# EAGLE design Ziliani-Apertura_Cancello (EAGLE 9.6.1)
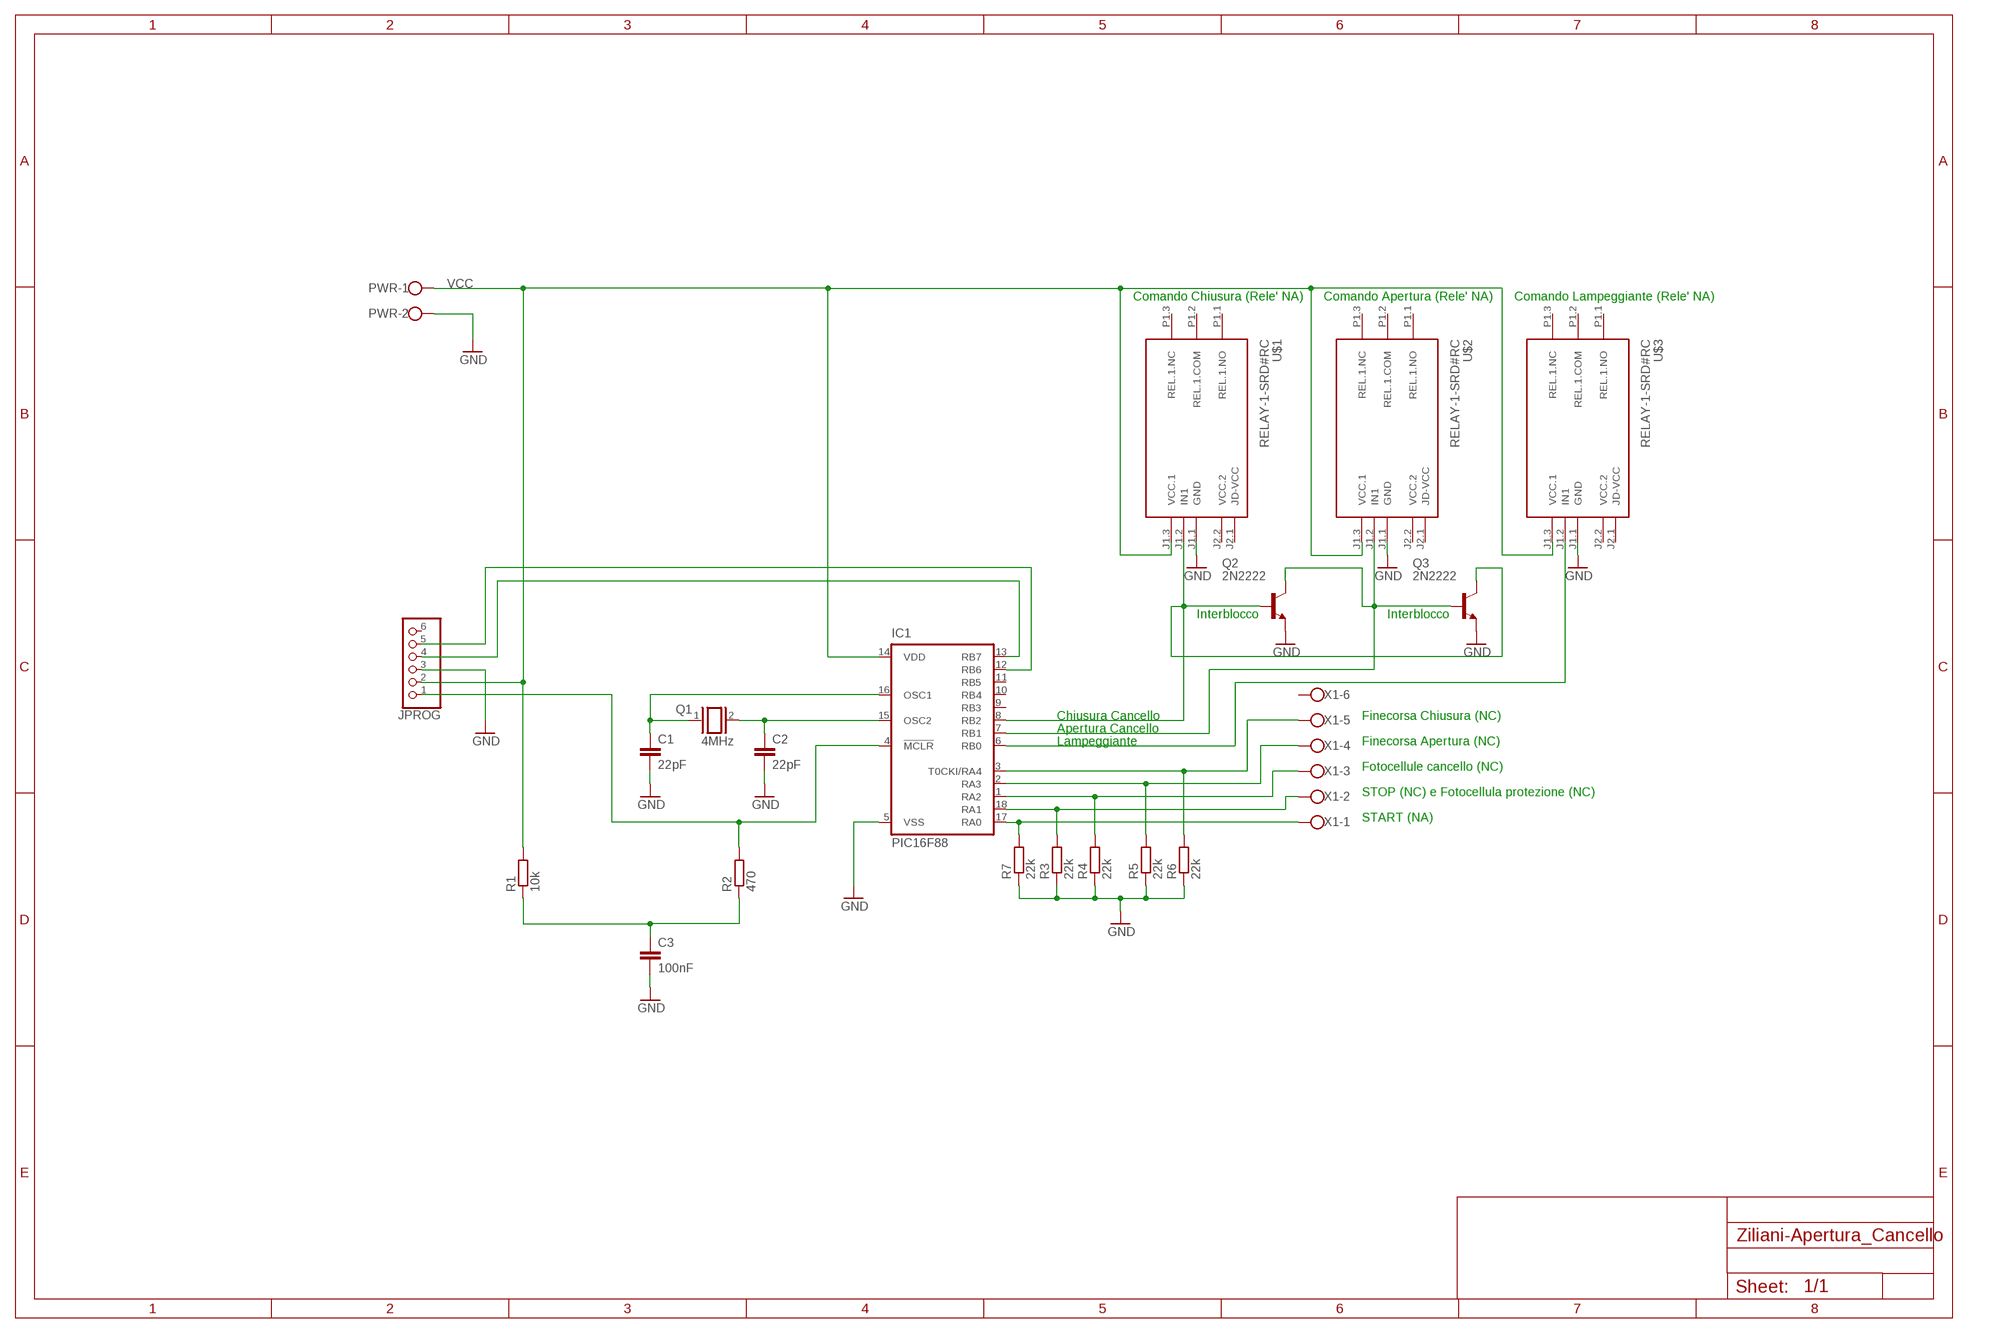
[diagram p0: schematic, sheet 1]

## Parts
C1  22pF  C-EU025-025X050  [C025-025X050]
C2  22pF  C-EU025-025X050  [C025-025X050]
C3  100nF  C-EU025-025X050  [C025-025X050]
IC1  PIC16F88  PIC16F84AP  [DIL18]
JPROG  PINHD-1X6/90  [1X06/90]
PWR  W237-102  [W237-102]
Q1  4MHz  XTAL/S  [QS]
Q2  2N2222  [TO18]
Q3  2N2222  [TO18]
R1  10k  R-EU_0207/10  [0207/10]
R2  470  R-EU_0207/10  [0207/10]
R3  22k  R-EU_0207/10  [0207/10]
R4  22k  R-EU_0207/10  [0207/10]
R5  22k  R-EU_0207/10  [0207/10]
R6  22k  R-EU_0207/10  [0207/10]
R7  22k  R-EU_0207/10  [0207/10]
U$1  RELAY-1-SRD#RC  [RELAY-1-SRD#RC]
U$2  RELAY-1-SRD#RC  [RELAY-1-SRD#RC]
U$3  RELAY-1-SRD#RC  [RELAY-1-SRD#RC]
X1  W237-6  [W237-6]

## Nets
GND: C1.2 C2.2 C3.2 IC1.5(VSS) JPROG.3 PWR.2 Q2.1(E) Q3.1(E) R3.1 R4.1 R5.1 R6.1 R7.1 U$1.J1.1(GND) U$2.J1.1(GND) U$3.J1.1(GND)
N$1: C1.1 IC1.16(OSC1) Q1.1
N$2: C2.1 IC1.15(OSC2) Q1.2
N$3: IC1.17(RA0) R7.2 X1.1
N$4: IC1.4(!MCLR) JPROG.1 R2.2
N$5: IC1.7(RB1) Q2.3(C) Q3.2(B) U$2.J1.2(IN1)
N$6: IC1.13(RB7) JPROG.4
N$7: IC1.12(RB6) JPROG.5
N$8: IC1.18(RA1) R3.2 X1.2
N$9: IC1.1(RA2) R4.2 X1.3
N$10: IC1.2(RA3) R5.2 X1.4
N$11: IC1.3(T0CKI/RA4) R6.2 X1.5
N$14: IC1.8(RB2) Q2.2(B) Q3.3(C) U$1.J1.2(IN1)
N$15: C3.1 R1.1 R2.1
N$16: IC1.6(RB0) U$3.J1.2(IN1)
VCC: IC1.14(VDD) JPROG.2 PWR.1 R1.2 U$1.J1.3(VCC.1) U$2.J1.3(VCC.1) U$3.J1.3(VCC.1)
Unconnected: IC1.9(RB3) IC1.10(RB4) IC1.11(RB5) JPROG.6 U$1.J2.1(JD-VCC) U$1.P1.1(REL.1.NO) U$1.P1.2(REL.1.COM) U$1.P1.3(REL.1.NC) U$2.J2.1(JD-VCC) U$2.P1.1(REL.1.NO) U$2.P1.2(REL.1.COM) U$2.P1.3(REL.1.NC) U$3.J2.1(JD-VCC) U$3.P1.1(REL.1.NO) U$3.P1.2(REL.1.COM) U$3.P1.3(REL.1.NC) X1.6

## Notes on the sheet
- Comando Chiusura (Rele' NA) | Comando Apertura (Rele' NA) | Comando Lampeggiante (Rele' NA)
- Interblocco | Interblocco
- Chiusura Cancello | Finecorsa Chiusura (NC)
- Apertura Cancello
- Lampeggiante | Finecorsa Apertura (NC)
- Fotocellule cancello (NC)
- STOP (NC) e Fotocellula protezione (NC)
- START (NA)

## Power pins joined to a net without a drawn wire
VCC.2: U$1.J2.2(VCC.2) U$2.J2.2(VCC.2) U$3.J2.2(VCC.2)

## Library data of the parts
C1-C3 = rcl:C-EU: CAPACITOR, European symbol; SPICEPREFIX: C
IC1 = microchip:PIC16F8*: MICROCONTROLLER 8-Bit PIC16F8X Family - CMOS Flash/EEPROM Pin Compatible : PIC16F83, PIC16CR83, PIC16F84A, PIC16CR84 see also PIC16C* <DEVICE:PIC16C*>; MF: MICROCHIP; MPN: PIC16F84A-04I/P; OC_FARNELL: 9760865; OC_NEWARK: 69K7635
JPROG = pinhead:PINHD-1X6: PIN HEADER
PWR = con-wago-500:W237-102: WAGO SCREW CLAMP; MPN: 237-102; OC_FARNELL: unknown; OC_NEWARK: 70K9898
Q1 = special:XTAL/S: CRYSTAL
Q2 Q3 = transistor-npn:2N2222*: NPN Transistor
R1-R7 = rcl:R-EU_: RESISTOR, European symbol; SPICEPREFIX: R
U$1-U$3 = diy-modules-PCB:RELAY-1-SRD#RC: 1-Channel Relay Module based on SRD-05VDC-SL-C relays Symbol with relays pins Click here to find device on ebay.com <http://www.ebay.com/sch/one+channel+isolated+relay+5v>
X1 = con-wago-500:W237-6: WAGO SCREW CLAMP; OC_FARNELL: unknown; OC_NEWARK: unknown

## Board
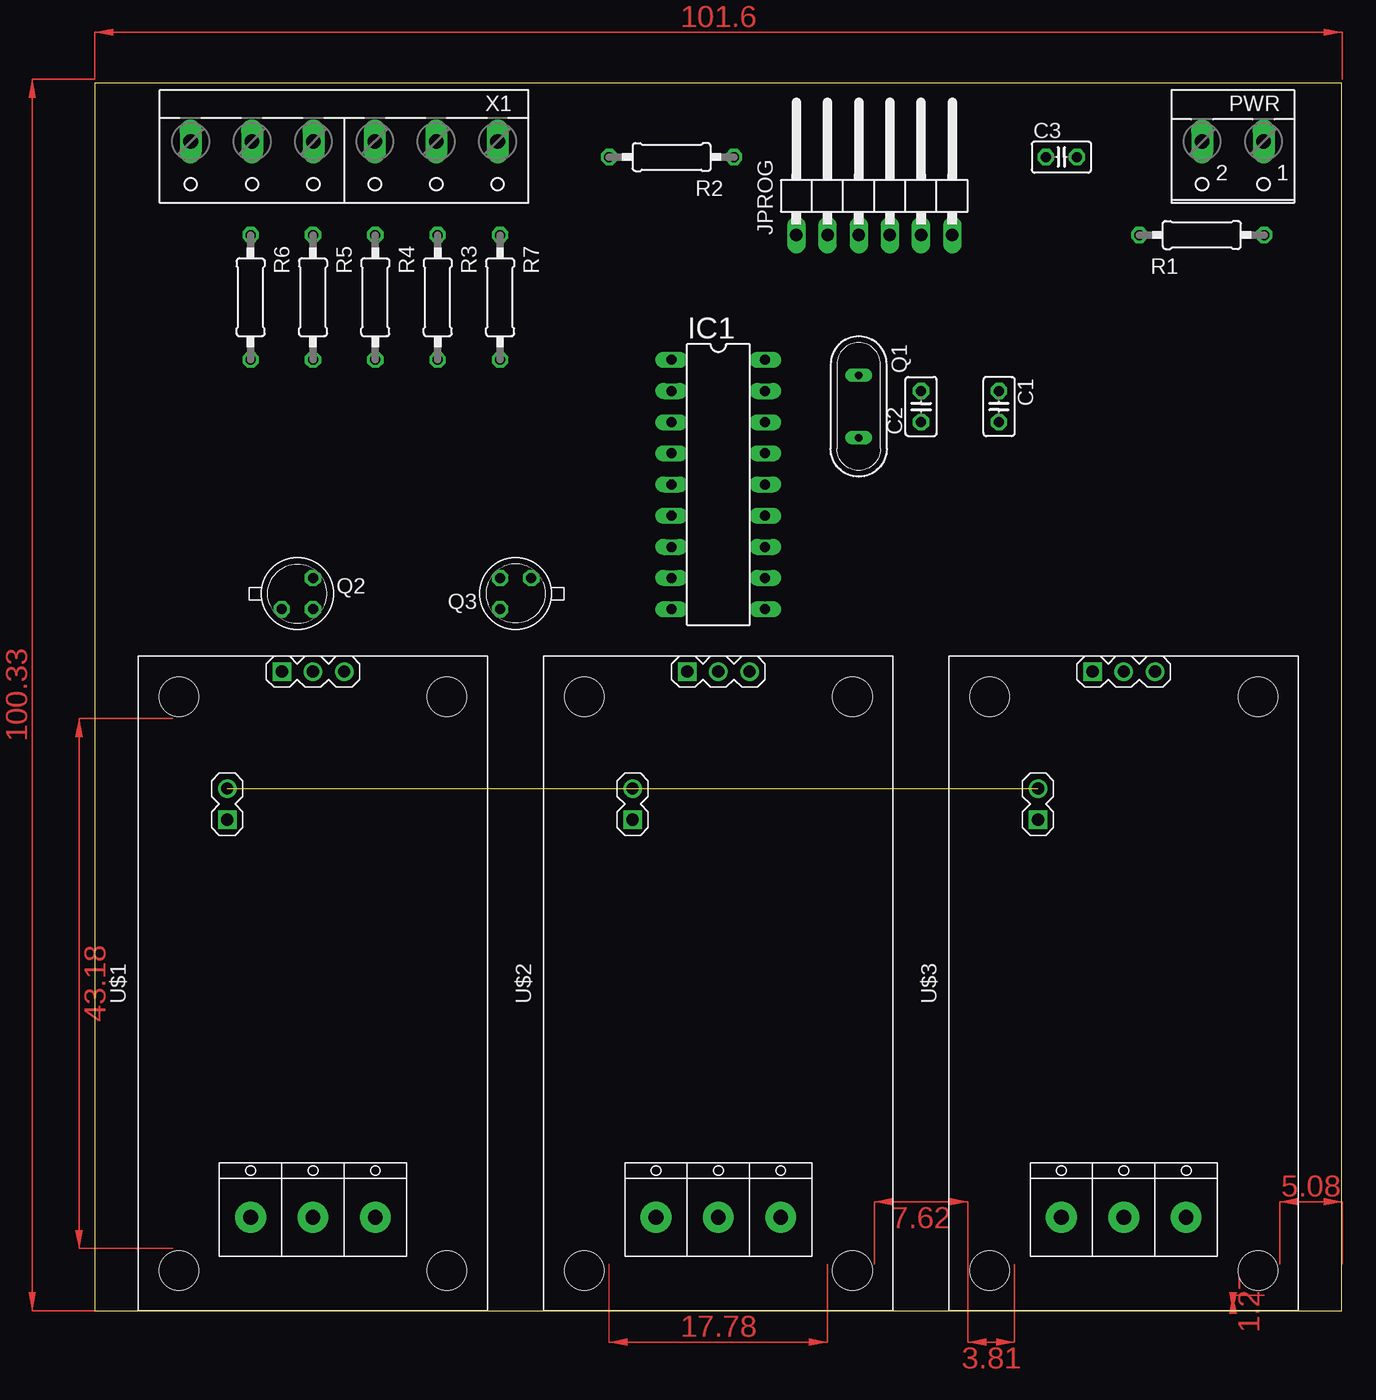
[diagram p1: board, top side]
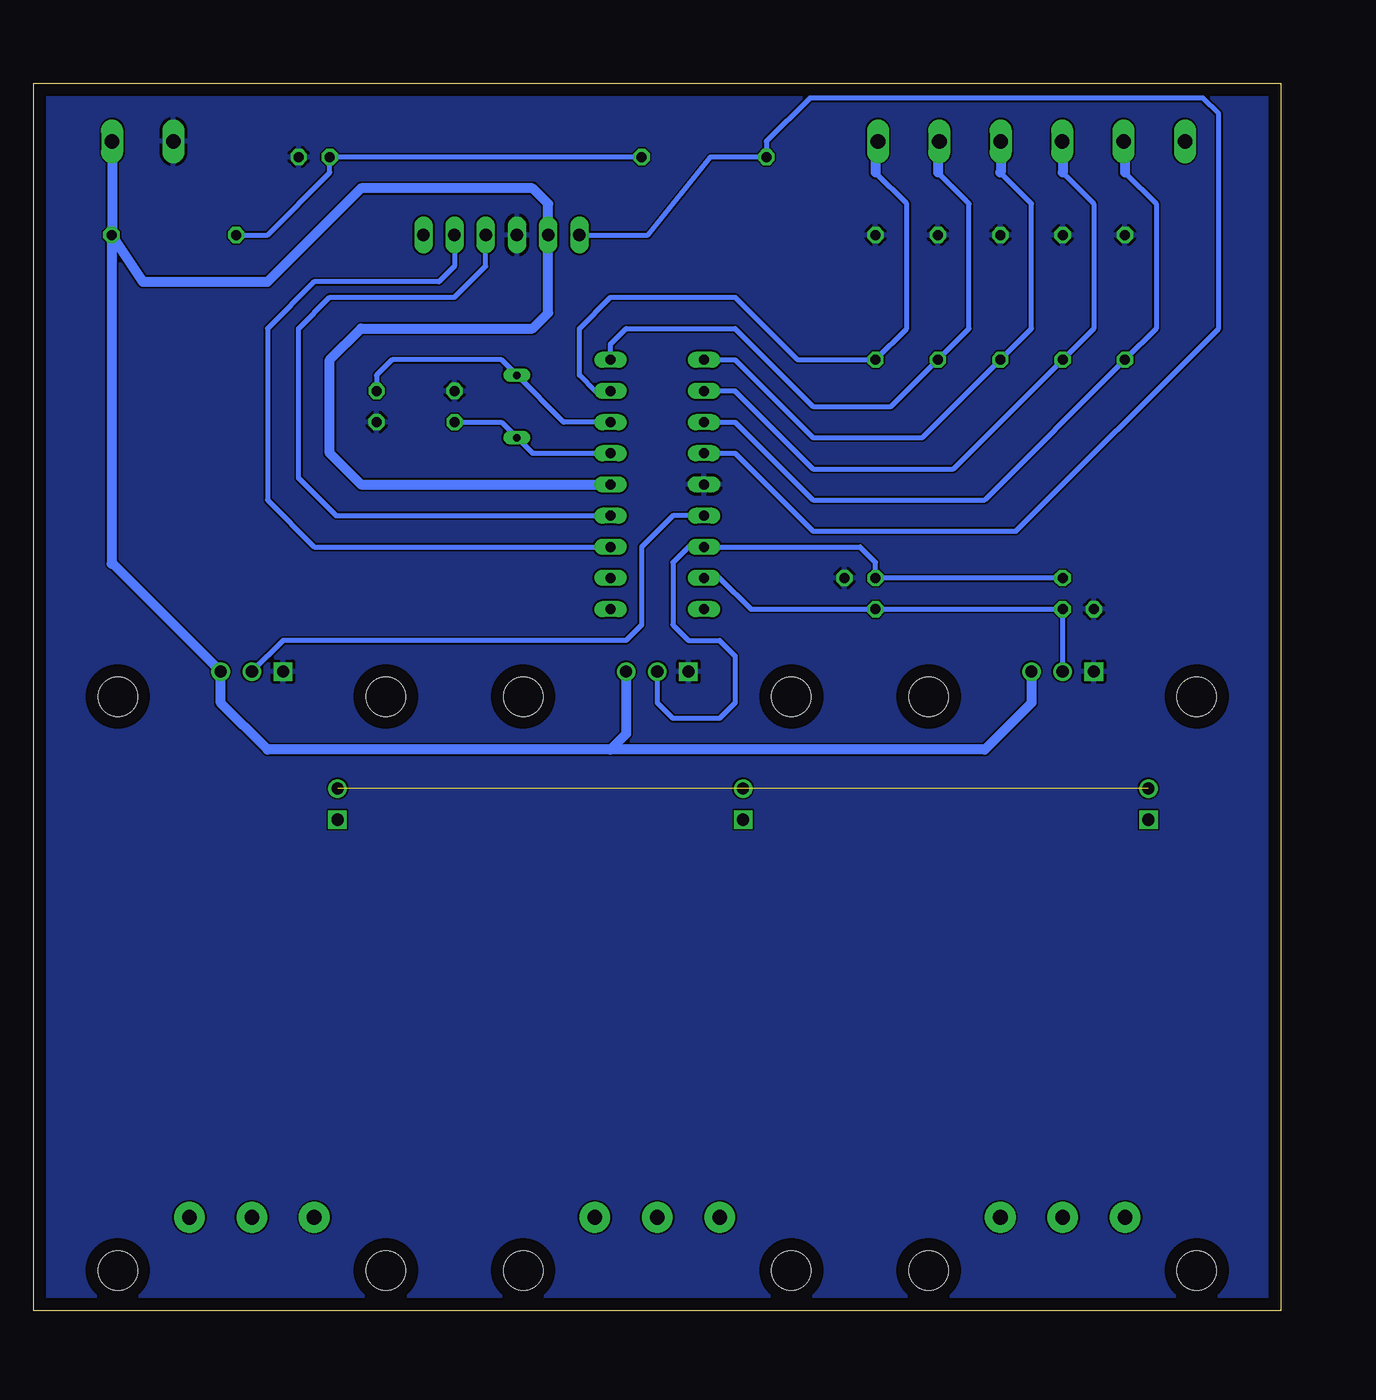
[diagram p2: board, bottom side, seen from below]

Size 101.58 x 100 mm. Coordinates in mm from the lower left corner, seen from the top.
Outline: 0,0 101.58,0 101.58,100 0,100 0,0
Copper layers (1*16): Top 0.035mm / dielectric 1.5mm / Bottom 0.035mm
Design rules "default": minimum track width 6mil, minimum drill 0.35mm, track to track 6mil, track to pad 6mil, pad to pad 6mil, via to via 6mil, smd to smd 6mil, copper to edge 40mil, drill to drill 6mil, minimum pad ring 10mil, minimum via ring 8mil, stop-mask expansion 4mil, vias tented up to drill 0mil, thermal gap 10mil

### Footprints (pad centres in the part's own frame; a part is rotated, then mirrored left to right if it is on the bottom)
C025-025X050 = drill 0.813 octagon: 1 -1.27,0; 2 1.27,0
DIL18 = drill 0.813 long: 1 -10.16,-3.81; 2 -7.62,-3.81; 3 -5.08,-3.81; 4 -2.54,-3.81; 5 0,-3.81; 6 2.54,-3.81; 7 5.08,-3.81; 8 7.62,-3.81; 9 10.16,-3.81; 10 10.16,3.81; 11 7.62,3.81; 12 5.08,3.81; 13 2.54,3.81; 14 0,3.81; 15 -2.54,3.81; 16 -5.08,3.81; 17 -7.62,3.81; 18 -10.16,3.81
1X06/90 = drill 1.016 long: 1 -6.35,-3.81; 2 -3.81,-3.81; 3 -1.27,-3.81; 4 1.27,-3.81; 5 3.81,-3.81; 6 6.35,-3.81
W237-102 = drill 1.194 long: 1 -2.5,-1.27; 2 2.5,-1.27
QS = drill 0.61 long: 1 -2.54,0; 2 2.54,0
TO18 = drill 0.813 octagon: 1 -1.27,-1.27; 2 1.27,-1.27; 3 1.27,1.27
0207/10 = drill 0.813 octagon: 1 -5.08,0; 2 5.08,0
RELAY-1-SRD#RC = drill 1 square: J1.1 25.4,2.54; J2.1 13.335,6.985 | drill 1: J1.2 25.4,0; J1.3 25.4,-2.54; J2.2 15.875,6.985 | drill 1.2 pad 2.5: P1.1 -19.05,5.08; P1.2 -19.05,0; P1.3 -19.05,-5.08 | hole 3.2: -23.368,10.922; 23.368,10.922; 23.368,-10.922; -23.368,-10.922
W237-6 = drill 1.194 long: 1 -12.5,-1.27; 2 -7.5,-1.27; 3 -2.5,-1.27; 4 2.5,-1.27; 5 7.5,-1.27; 6 12.5,-1.27

### Placement (x,y rotation side)
C1  73.66,73.66 270 top
C2  67.31,73.66 90 top
C3  78.74,93.98 0 top
IC1  50.8,67.31 270 top
JPROG  63.5,91.44 0 top
PWR  92.71,93.98 180 top
Q1  62.23,73.66 270 top
Q2  16.51,58.42 0 top
Q3  34.29,58.42 180 top
R1  90.17,87.63 0 top
R2  46.99,93.98 180 top
R3  27.94,82.55 270 top
R4  22.86,82.55 270 top
R5  17.78,82.55 270 top
R6  12.7,82.55 270 top
R7  33.02,82.55 270 top
U$1  17.78,26.67 90 top
U$2  50.8,26.67 90 top
U$3  83.82,26.67 90 top
X1  20.32,93.98 180 top

### Tracks (layer width: path | path; a pad name or v marks a point on that pad's centre or on a via)
GND
  pour Bottom: 0,0 0,100.33 101.6,100.33 101.6,0
N$1
  Bottom 0.406: C1.1 73.66,76.2 72.39,77.47 63.5,77.47 Q1.1 58.42,72.39 IC1.16
N$2
  Bottom 0.406: C2.1 63.5,72.39 Q1.2 60.96,69.85 IC1.15
N$3
  Bottom 0.406: 33.02,92.71 30.48,90.17 30.48,80.01 R7.2 39.37,77.47 44.45,82.55 54.61,82.55 57.15,80.01 57.15,76.2 55.88,74.93 IC1.17
  Bottom 0.813: X1.1 33.02,95.05 33.02,92.71
N$4
  Bottom 0.406: JPROG.1 51.56,87.63 46.48,93.98 R2.2 41.91,95.25 38.38,98.78 6.35,98.78 5.08,97.51 5.08,80.01 21.59,63.5 38.1,63.5 44.45,69.85 IC1.4
N$5
  Bottom 0.406: U$2.J1.2 50.8,49.53 49.53,48.26 45.72,48.26 44.45,49.53 44.45,53.34 45.72,54.61 48.26,54.61 49.53,55.88 49.53,60.96 48.26,62.23 IC1.7 34.29,62.23 33.02,60.96 Q3.2 Q2.3
N$6
  Bottom 0.406: IC1.13 76.96,64.77 80.01,67.82 80.01,80.01 77.47,82.55 67.31,82.55 64.77,85.09 JPROG.4
N$7
  Bottom 0.406: IC1.12 78.74,62.23 82.55,66.04 82.55,80.01 78.74,83.82 68.58,83.82 67.31,85.09 JPROG.5
N$8
  Bottom 0.406: 27.94,92.71 25.4,90.17 25.4,80.01 R3.2 31.75,73.66 38.1,73.66 44.45,80.01 53.34,80.01 54.61,78.74 IC1.18
  Bottom 0.813: X1.2 27.94,95.13 27.94,92.71
N$9
  Bottom 0.406: IC1.1 44.45,77.47 38.1,71.12 29.21,71.12 R4.2 20.32,80.01 20.32,90.17 22.86,92.71
  Bottom 0.813: X1.3 22.82,92.75 22.86,92.71
N$10
  Bottom 0.406: 17.78,92.71 15.24,90.17 15.24,80.01 R5.2 26.67,68.58 38.1,68.58 44.45,74.93 IC1.2
  Bottom 0.813: X1.4 17.78,95.21 17.78,92.71
N$11
  Bottom 0.406: 12.7,92.71 10.16,90.17 10.16,80.01 R6.2 24.13,66.04 38.1,66.04 44.45,72.39 IC1.3
  Bottom 0.813: X1.5 12.7,95.13 12.7,92.71
N$14
  Bottom 0.406: U$1.J1.2 Q2.2 Q3.3 43.18,57.15 45.72,59.69 IC1.8
N$15
  Bottom 0.406: R1.1 82.55,87.63 77.47,92.71 C3.1 R2.1
N$16
  Bottom 0.406: U$3.J1.2 81.28,54.61 53.34,54.61 52.07,55.88 52.07,62.23 49.53,64.77 IC1.6
VCC
  Bottom 0.813: IC1.14 74.93,67.31 77.47,69.85 77.47,77.47 74.93,80.01 60.96,80.01 59.69,81.28 JPROG.2 59.69,90.17 60.96,91.44 74.93,91.44 82.55,83.82 92.71,83.82 R1.2 | U$2.J1.3 53.34,46.99 54.61,45.72 | 54.61,45.72 82.55,45.72 86.36,49.53 U$3.J1.3 95.14,60.85 95.25,60.85 R1.2 | PWR.1 95.21,87.65 R1.2 | U$1.J1.3 20.32,49.53 24.13,45.72 54.61,45.72
VCC.2  (2 unrouted)
(copper drawn outside any net)
  shapes: Top area x8